# Altium schematic sheet Sheet4.SchDoc
size A4
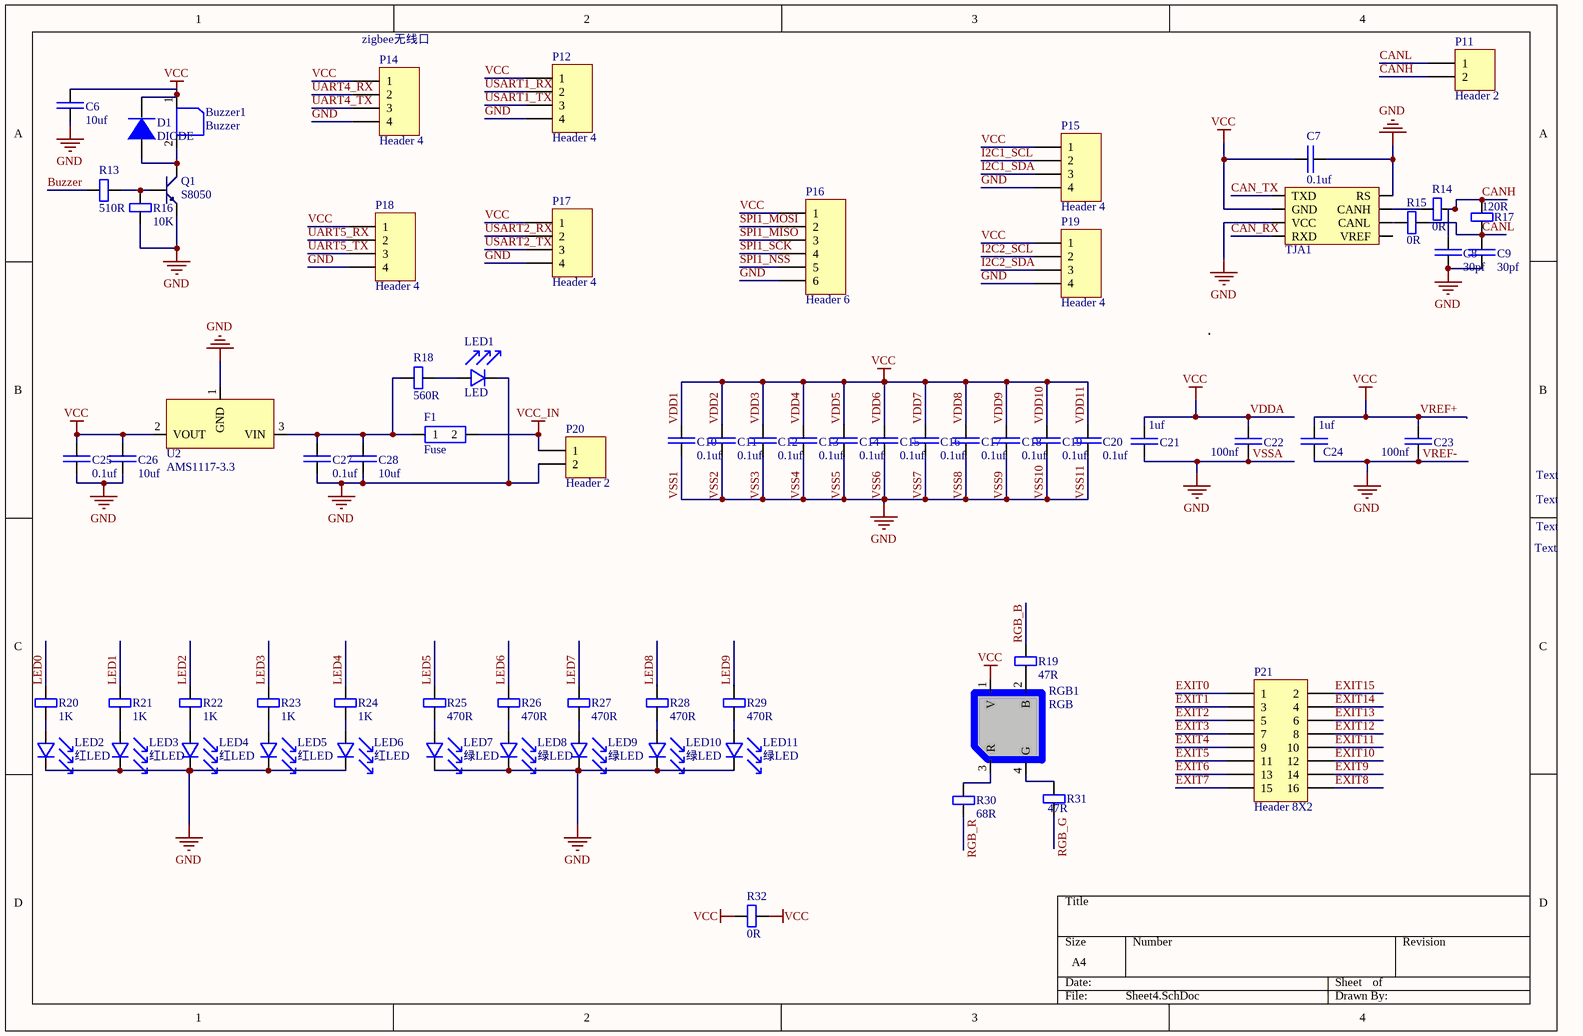
[diagram p0: Sheet4.SchDoc]

## Parts
Buzzer1  Buzzer  [BUZZER]
C6  10uf  [0402]
C7  0.1uf  [0402]
C8  30pf  [0402]
C9  30pf  [0402]
C10  0.1uf  [0402]
C11  0.1uf  [0402]
C12  0.1uf  [0402]
C13  0.1uf  [0402]
C14  0.1uf  [0402]
C15  0.1uf  [0402]
C16  0.1uf  [0402]
C17  0.1uf  [0402]
C18  0.1uf  [0402]
C19  0.1uf  [0402]
C20  0.1uf  [0402]
C21  1uf  [0402]
C22  100nf  [0402]
C23  100nf  [0402]
C24  1uf  [0402]
C25  0.1uf  [0402]
C26  10uf  [0402]
C27  0.1uf  [0402]
C28  10uf  [0402]
D1  DIODE  [DIODE]
F1  Fuse  [0805]
LED1  LED  [0603]
LED2  红LED  [0603]
LED3  红LED  [0603]
LED4  红LED  [0603]
LED5  红LED  [0603]
LED6  红LED  [0603]
LED7  绿LED  [0603]
LED8  绿LED  [0603]
LED9  绿LED  [0603]
LED10  绿LED  [0603]
LED11  绿LED  [0603]
P11  Header 2  [GH1.25_2P]
P12  Header 4  [GH1.25_4P]
P14  Header 4  [GH1.25_4P]
P15  Header 4  [GH1.25_4P]
P16  Header 6  [HDR1X6]
P17  Header 4  [GH1.25_4P]
P18  Header 4  [GH1.25_4P]
P19  Header 4  [GH1.25_4P]
P20  Header 2  [XT30-PW-M]
P21  Header 8X2  [HDR2X8]
Q1  S8050  [SOT-23R]
R13  510R  [0402]
R14  0R  [0402]
R15  0R  [0402]
R16  10K  [0402]
R17  120R  [0402]
R18  560R  [0402]
R19  47R  [0402]
R20  1K  [0402]
R21  1K  [0402]
R22  1K  [0402]
R23  1K  [0402]
R24  1K  [0402]
R25  470R  [0402]
R26  470R  [0402]
R27  470R  [0402]
R28  470R  [0402]
R29  470R  [0402]
R30  68R  [0402]
R31  47R  [0402]
R32  0R  [0603]
RGB1  RGB  [RGB_LED]
TJA1  TJA1050  [TJA1050]  (value not drawn)
U2  AMS1117-3.3  [ASM1117]

## Nets
GND: C6.1 C7.2 C8.1 C9.1 C10.1 C11.1 C12.1 C13.1 C14.1 C15.1 C16.1 C17.1 C18.1 C19.1 C20.1 C21.1 C22.1 C23.1 C24.1 C25.2 C26.2 C27.2 C28.2 LED1.2 LED2.2 LED3.2 LED4.2 LED5.2 LED6.2 LED7.2 LED8.2 LED9.2 LED10.2 LED11.2 P12.4 P14.4 P15.4 P16.6 P17.4 P18.4 P19.4 P20.2 Q1.1(E) R16.1 TJA1.3(VCC) TJA1.8(RS) U2.1(GND)  [also labelled VREF-, VSS1, VSS10, VSS11, VSS2, VSS3, VSS4, VSS5, VSS6, VSS7, VSS8, VSS9, VSSA]
VCC: Buzzer1.1 C6.2 C7.1 C10.2 C11.2 C12.2 C13.2 C14.2 C15.2 C16.2 C17.2 C18.2 C19.2 C20.2 C21.2 C22.2 C23.2 C24.2 C25.1 C26.1 D1.1 P12.1 P14.1 P15.1 P16.1 P17.1 P18.1 P19.1 R32.1 R32.2 RGB1.1(V) TJA1.2(GND) U2.2(VOUT)  [also labelled VDD1, VDD10, VDD11, VDD2, VDD3, VDD4, VDD5, VDD6, VDD7, VDD8, VDD9, VDDA, VREF+]
VCC_IN: F1.2 P20.1
Buzzer: R13.1
CAN_RX: TJA1.4(RXD)
CAN_TX: TJA1.1(TXD)
CANH: C8.2 P11.2 R14.2 R17.2
CANL: C9.2 P11.1 R15.2 R17.1
EXIT0: P21.1
EXIT1: P21.3
EXIT2: P21.5
EXIT3: P21.7
EXIT4: P21.9
EXIT5: P21.11
EXIT6: P21.13
EXIT7: P21.15
EXIT8: P21.16
EXIT9: P21.14
EXIT10: P21.12
EXIT11: P21.10
EXIT12: P21.8
EXIT13: P21.6
EXIT14: P21.4
EXIT15: P21.2
I2C1_SCL: P15.2
I2C1_SDA: P15.3
I2C2_SCL: P19.2
I2C2_SDA: P19.3
LED0: R20.2
LED1: R21.2
LED2: R22.2
LED3: R23.2
LED4: R24.2
LED5: R25.2
LED6: R26.2
LED7: R27.2
LED8: R28.2
LED9: R29.2
RGB_B: R19.2
RGB_G: R31.1
RGB_R: R30.1
SPI1_MISO: P16.3
SPI1_MOSI: P16.2
SPI1_NSS: P16.5
SPI1_SCK: P16.4
UART4_RX: P14.2
UART4_TX: P14.3
UART5_RX: P18.2
UART5_TX: P18.3
USART1_RX: P12.2
USART1_TX: P12.3
USART2_RX: P17.2
USART2_TX: P17.3
NetBuzzer1_2: Buzzer1.2 D1.2 Q1.3(C)
NetC27_1: C27.1 C28.1 F1.1 R18.1 U2.3(VIN)
NetLED1_1: LED1.1 R18.2
NetLED2_1: LED2.1 R20.1
NetLED3_1: LED3.1 R21.1
NetLED4_1: LED4.1 R22.1
NetLED5_1: LED5.1 R23.1
NetLED6_1: LED6.1 R24.1
NetLED7_1: LED7.1 R25.1
NetLED8_1: LED8.1 R26.1
NetLED9_1: LED9.1 R27.1
NetLED10_1: LED10.1 R28.1
NetLED11_1: LED11.1 R29.1
NetQ1_2: Q1.2(B) R13.2 R16.2
NetR14_1: R14.1 TJA1.7(CANH)
NetR15_1: R15.1 TJA1.6(CANL)
NetR19_1: R19.1 RGB1.2(B)
NetR30_2: R30.2 RGB1.3(R)
NetR31_2: R31.2 RGB1.4(G)

Not connected (* = marked no-connect by the designer): TJA1 5(VREF)

## Notes on the sheet
- (near P14) zigbee无线口
- Text

## Library data of the parts
C6-C28 = C
LED2-LED11 = LED
P11 P20 = Header 2: Header, 2-Pin; LatestRevisionDate: 17-Jul-2002; LatestRevisionNote: Re-released for DXP Platform.; Publisher: Altium Limited
P12 P14 P15 P17-P19 = Header 4: Header, 4-Pin; LatestRevisionDate: 17-Jul-2002; LatestRevisionNote: Re-released for DXP Platform.; Publisher: Altium Limited
P16 = Header 6: Header, 6-Pin; LatestRevisionDate: 17-Jul-2002; LatestRevisionNote: Re-released for DXP Platform.; Publisher: Altium Limited
P21 = Header 8X2: Header, 8-Pin, Dual row; LatestRevisionDate: 17-Jul-2002; LatestRevisionNote: Re-released for DXP Platform.; Publisher: Altium Limited
Q1 = NPN: 8050/BCW846/BCW847
R13-R32 = R